# EAGLE design packmonitor (EAGLE 7.3.0)
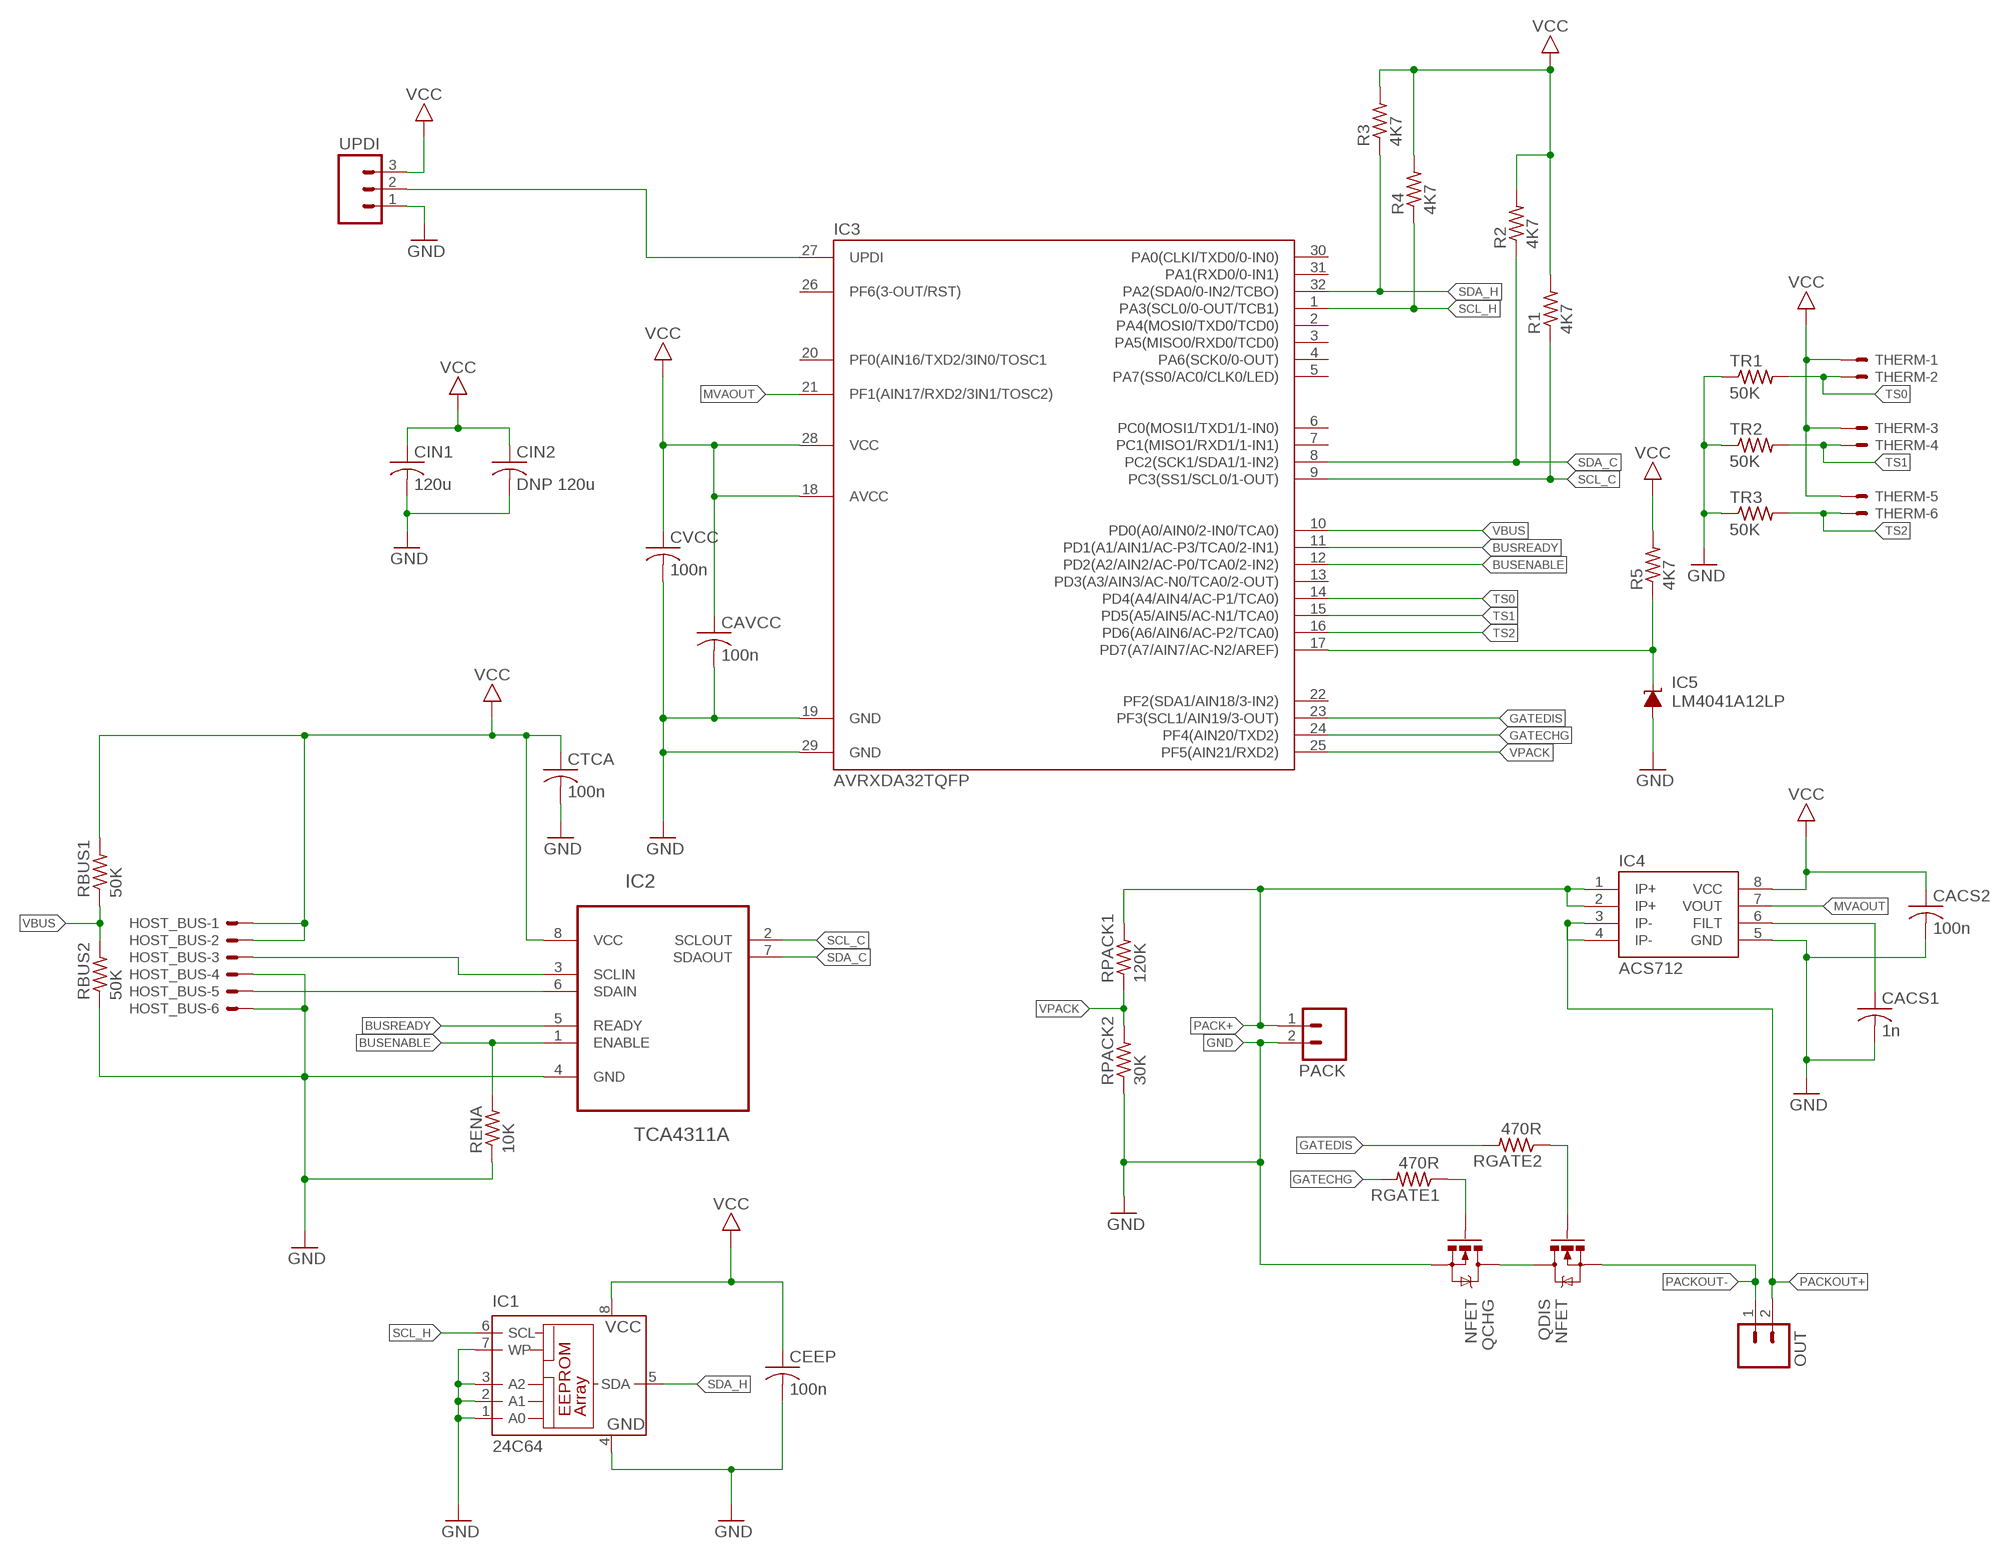
[diagram p0: schematic, sheet 1]

## Parts
CACS1  1n  C-USC0603  [C0603]
CACS2  100n  C-USC0603  [C0603]
CAVCC  100n  C-USC0603  [C0603]
CEEP  100n  C-USC0603  [C0603]
CIN1  120u  C-USC1206  [C1206]
CIN2  DNP 120u  C-USC1206  [C1206]
CTCA  100n  C-USC0603  [C0603]
CVCC  100n  C-USC0603  [C0603]
HOST_BUS  JST-XH-06-PIN-LONG-PAD  [JST-XH-06-PACKAGE-LONG-PAD]
IC1  24C64  24C04CSN  [SO-08]
IC2  TCA4311A  PCA9511AD,118  [SOIC127P600X175-8N]
IC3  AVRXDA32TQFP  [TQFP32-08]
IC4  ACS712  [SO08]
IC5  LM4041A12LP  [LP_O-PBCY-W3]
OUT  M023.5MM  [SCREWTERMINAL-3.5MM-2]
PACK  M023.5MM  [SCREWTERMINAL-3.5MM-2]
QCHG  NFET  MOSFET-NCHANNELFDS6630A  [SO08]
QDIS  NFET  MOSFET-NCHANNELFDS6630A  [SO08]
R1  4K7  R-US_R0603  [R0603]
R2  4K7  R-US_R0603  [R0603]
R3  4K7  R-US_R0603  [R0603]
R4  4K7  R-US_R0603  [R0603]
R5  4K7  R-US_R0603  [R0603]
RBUS1  50K  R-US_R0805  [R0805]
RBUS2  50K  R-US_R0805  [R0805]
RENA  10K  R-US_R0603  [R0603]
RGATE1  470R  R-US_R0603  [R0603]
RGATE2  470R  R-US_R0603  [R0603]
RPACK1  120K  R-US_R0805  [R0805]
RPACK2  30K  R-US_R0805  [R0805]
THERM  JST-XH-06-PIN-ROUND-PAD  [JST-XH-06-PACKAGE-ROUND-PAD]
TR1  50K  R-US_R0805  [R0805]
TR2  50K  R-US_R0805  [R0805]
TR3  50K  R-US_R0805  [R0805]
UPDI  M03PTH  [1X03]

## Nets
BUSENABLE: IC2.1(ENABLE) IC3.12(PD2(A2/AIN2/AC-P0/TCA0/2-IN2)) RENA.2
BUSREADY: IC2.5(READY) IC3.11(PD1(A1/AIN1/AC-P3/TCA0/2-IN1))
GATECHG: IC3.24(PF4(AIN20/TXD2)) RGATE1.2
GATEDIS: IC3.23(PF3(SCL1/AIN19/3-OUT)) RGATE2.2
GND: CACS1.2 CACS2.2 CAVCC.2 CEEP.2 CIN1.2 CIN2.2 CTCA.2 CVCC.2 HOST_BUS.4 HOST_BUS.6 IC1.1(A0) IC1.2(A1) IC1.3(A2) IC1.4(GND) IC1.7(WP) IC2.4(GND) IC3.19(GND) IC3.29(GND) IC4.5(GND) IC5.3(A) PACK.2 QCHG.1(S) QCHG.2(S) QCHG.3(S) RBUS2.1 RENA.1 RPACK2.1 TR1.1 TR2.1 TR3.1 UPDI.1
MVAOUT: IC3.21(PF1(AIN17/RXD2/3IN1/TOSC2)) IC4.7(VOUT)
N$1: QCHG.4(G) RGATE1.1
N$2: QDIS.4(G) RGATE2.1
N$3: CACS1.1 IC4.6(FILT)
N$4: IC3.17(PD7(A7/AIN7/AC-N2/AREF)) IC5.2(C) R5.1
PACK+: IC4.1(IP+) IC4.2(IP+) PACK.1 RPACK1.2
PACKOUT+: IC4.3(IP-) IC4.4(IP-) OUT.2
PACKOUT-: OUT.1 QDIS.1(S) QDIS.2(S) QDIS.3(S)
PDISC: QCHG.5(D) QCHG.6(D) QCHG.7(D) QCHG.8(D) QDIS.5(D) QDIS.6(D) QDIS.7(D) QDIS.8(D)
SCL_C: IC2.2(SCLOUT) IC3.9(PC3(SS1/SCL0/1-OUT)) R1.1
SCL_H: IC1.6(SCL) IC3.1(PA3(SCL0/0-OUT/TCB1)) R4.1
SCLIN: HOST_BUS.3 IC2.3(SCLIN)
SDA_C: IC2.7(SDAOUT) IC3.8(PC2(SCK1/SDA1/1-IN2)) R2.1
SDA_H: IC1.5(SDA) IC3.32(PA2(SDA0/0-IN2/TCBO)) R3.1
SDAIN: HOST_BUS.5 IC2.6(SDAIN)
TS0: IC3.14(PD4(A4/AIN4/AC-P1/TCA0)) THERM.2 TR1.2
TS1: IC3.15(PD5(A5/AIN5/AC-N1/TCA0)) THERM.4 TR2.2
TS2: IC3.16(PD6(A6/AIN6/AC-P2/TCA0)) THERM.6 TR3.2
UPDI: IC3.27(UPDI) UPDI.2
VBUS: IC3.10(PD0(A0/AIN0/2-IN0/TCA0)) RBUS1.1 RBUS2.2
VCC: CACS2.1 CAVCC.1 CEEP.1 CIN1.1 CIN2.1 CTCA.1 CVCC.1 HOST_BUS.1 HOST_BUS.2 IC1.8(VCC) IC2.8(VCC) IC3.18(AVCC) IC3.28(VCC) IC4.8(VCC) R1.2 R2.2 R3.2 R4.2 R5.2 RBUS1.2 THERM.1 THERM.3 THERM.5 UPDI.3
VPACK: IC3.25(PF5(AIN21/RXD2)) RPACK1.1 RPACK2.2
Unconnected: IC3.2(PA4(MOSI0/TXD0/TCD0)) IC3.3(PA5(MISO0/RXD0/TCD0)) IC3.4(PA6(SCK0/0-OUT)) IC3.5(PA7(SS0/AC0/CLK0/LED)) IC3.6(PC0(MOSI1/TXD1/1-IN0)) IC3.7(PC1(MISO1/RXD1/1-IN1)) IC3.13(PD3(A3/AIN3/AC-N0/TCA0/2-OUT)) IC3.20(PF0(AIN16/TXD2/3IN0/TOSC1) IC3.22(PF2(SDA1/AIN18/3-IN2)) IC3.26(PF6(3-OUT/RST)) IC3.30(PA0(CLKI/TXD0/0-IN0)) IC3.31(PA1(RXD0/0-IN1))

## Library data of the parts
CACS1 CACS2 CAVCC CEEP CIN1 CIN2 CTCA CVCC = rcl:C-US: CAPACITOR, American symbol
HOST_BUS THERM = Rembrandt Electronics - JST XH Connectors v1-0:JST-XH-06-PIN: JST XH Connector 2 Pin Wire to board connector. Pitch: 2,54 mm, (0.100") Number of pins: 6 Created by Rembrandt Electronics www.rembrandtelectronics.com
IC1 = microchip:24C*: Serial EEPROM 1 K/2 K/4 K; OC_FARNELL: unknown; OC_NEWARK: unknown
IC2 = NXP_By_element14_Batch_1:PCA9511AD,118: Hot swappable I2C-bus and SMBus bus buffer; MPN: PCA9511AD,118; OC_FARNELL: -; OC_NEWARK: 70R6468; PACKAGE: SOIC-8; SUPPLIER: NXP
IC3 = microchip-special:AVRXDA32: The AVR128DA28/32/48/64 microcontrollers of the AVR® DA family are using the AVR CPU with hardware multiplier, running at up to 24 MHz, with 128 KB of Flash, 16 KB of SRAM, and 512B of EEPROM in 28-, 32-, 48- or 64-pin packages. The AVR® DA family uses the latest technologies from Microchip Technology, with a flexible and low-power architecture including Event System, intelligent analog features, advanced digital peripherals and Peripheral Touch Controller (PTC).
IC4 = SparkFun-AnalogIC:ACS712: Hall-effect-based isolated linear current sensor; PROD_ID: IC-08964
IC5 = texas:LM4041: PRECISION MICROPOWER SHUNT VOLTAGE REFERENCE Source: http://focus.ti.com/lit/ds/slcs146e/slcs146e.pdf; OC_FARNELL: 9486119; OC_NEWARK: unknown
OUT PACK = SparkFun-Connectors:M02: Standard 2-pin 0.1" header. Use with - straight break away headers ( PRT-00116) - right angle break away headers (PRT-00553) - swiss pins (PRT-00743) - machine pins (PRT-00117) - female headers (PRT-00115) Molex polarized connector foot print use with: PRT-08233 with associated crimp pins and housings. 2.54_SCREWTERM for use with PRT-10571. 3.5mm Screw Terminal footprints for PRT-08084 5mm Screw Terminal footprints for use with PRT-08432; PROD_ID: CONN-08399
QCHG QDIS = SparkFun-DiscreteSemi:MOSFET-NCHANNEL: Common NMOSFET Parts MFG P/N Store ID Prod ID FDD8780 TRANS-09984 SI7820DN TRANS-11055 FDS6630A IC-08089 2N7002PW TRANS-11151 FQP30N06L COM-10213 TRANS-10060 BSS123LT1G TRANS-08345 BSS138 TRANS-00830 BS170 2N7000; PROD_ID: IC-08089
R1-R5 RBUS1 RBUS2 RENA RGATE1 RGATE2 RPACK1 RPACK2 TR1-TR3 = rcl:R-US_: RESISTOR, American symbol
UPDI = SparkFun-Connectors:M03: Header 3 Standard 3-pin 0.1" header. Use with straight break away headers (SKU : PRT-00116), right angle break away headers (PRT-00553), swiss pins (PRT-00743), machine pins (PRT-00117), and female headers (PRT-00115). Molex polarized connector foot print use with SKU : PRT-08232 with associated crimp pins and housings.

## Board
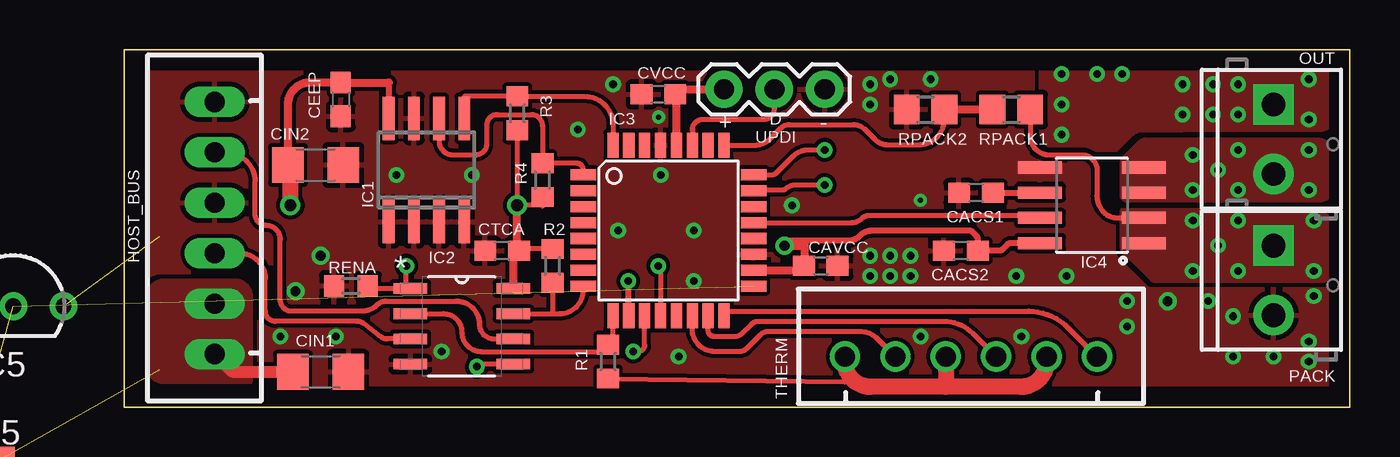
[diagram p1: board, top side]
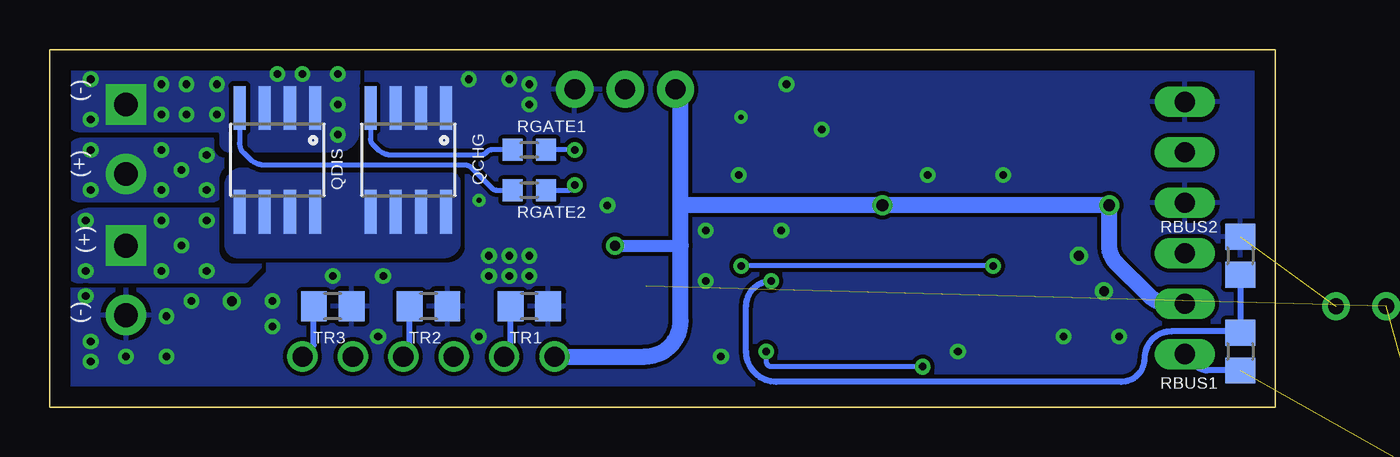
[diagram p2: board, bottom side, seen from below]

Size 61.76 x 18 mm. Coordinates in mm from the lower left corner, seen from the top.
Outline: 0,0 61.76,0 61.76,18 0,18 0,0
Copper layers (1*16): Top 0.035mm / dielectric 1.5mm / Bottom 0.035mm
Design rules "default": minimum track width 10mil, minimum drill 24mil, track to track 8mil, track to pad 8mil, pad to pad 8mil, via to via 8mil, smd to smd 8mil, copper to edge 40mil, drill to drill 8mil, minimum pad ring 10mil, minimum via ring 8mil, stop-mask expansion 4mil, vias tented up to drill 0mil, thermal gap 10mil

### Footprints (pad centres in the part's own frame; a part is rotated, then mirrored left to right if it is on the bottom)
C0603 = smd 1.1 x 1: 1 -0.85,0; 2 0.85,0
C1206 = smd 1.6 x 1.8: 1 -1.4,0; 2 1.4,0
JST-XH-06-PACKAGE-LONG-PAD = drill 1.016 long: 1 -6.35,0; 2 -3.81,0; 3 -1.27,0; 4 1.27,0; 5 3.81,0; 6 6.35,0
SO-08 = smd 0.6 x 2.2: 1 -1.905,-2.6; 2 -0.635,-2.6; 3 0.635,-2.6; 4 1.905,-2.6; 5 1.905,2.6; 6 0.635,2.6; 7 -0.635,2.6; 8 -1.905,2.6
SOIC127P600X175-8N = smd 1.702 x 0.533: 1 -2.591,1.905; 2 -2.591,0.635; 3 -2.591,-0.635; 4 -2.591,-1.905; 5 2.591,-1.905; 6 2.591,-0.635; 7 2.591,0.635; 8 2.591,1.905
TQFP32-08 = smd 1.27 x 0.559: 1 -4.293,2.8; 2 -4.293,2; 3 -4.293,1.2; 4 -4.293,0.4; 5 -4.293,-0.4; 6 -4.293,-1.2; 7 -4.293,-2; 8 -4.293,-2.8; 17 4.293,-2.8; 18 4.293,-2; 19 4.293,-1.2; 20 4.293,-0.4; 21 4.293,0.4; 22 4.293,1.2; 23 4.293,2; 24 4.293,2.8 | smd 0.559 x 1.27: 9 -2.8,-4.293; 10 -2,-4.293; 11 -1.2,-4.293; 12 -0.4,-4.293; 13 0.4,-4.293; 14 1.2,-4.293; 15 2,-4.293; 16 2.8,-4.293; 25 2.8,4.293; 26 2,4.293; 27 1.2,4.293; 28 0.4,4.293; 29 -0.4,4.293; 30 -1.2,4.293; 31 -2,4.293; 32 -2.8,4.293
SO08 = smd 0.61 x 2.21: 1 -1.905,-2.616; 2 -0.635,-2.616; 3 0.635,-2.616; 4 1.905,-2.616; 5 1.905,2.616; 6 0.635,2.616; 7 -0.635,2.616; 8 -1.905,2.616
LP_O-PBCY-W3 = drill 0.8 pad 1.4: 1 -2.54,0; 2 0,0; 3 2.54,0
SCREWTERMINAL-3.5MM-2 = drill 1.2 pad 2.032 square: 1 0,0 | drill 1.2 pad 2.032: 2 3.5,0
R0603 = smd 1 x 1.1: 1 -0.85,0; 2 0.85,0
R0805 = smd 1.3 x 1.5: 1 -0.95,0; 2 0.95,0
JST-XH-06-PACKAGE-ROUND-PAD = drill 1.016: 1 -6.35,0; 2 -3.81,0; 3 -1.27,0; 4 1.27,0; 5 3.81,0; 6 6.35,0
1X03 = drill 1.016 pad 1.88: 1 0,0; 2 2.54,0; 3 5.08,0

### Placement (x,y rotation side)
CACS1  42.93,10.79 180 top
CACS2  42.16,7.87 180 top
CAVCC  35.1,7.11 0 top
CEEP  10.92,15.49 270 top
CIN1  9.91,1.78 0 top
CIN2  9.65,12.19 0 top
CTCA  19.05,7.87 180 top
CVCC  26.92,15.75 180 top
HOST_BUS  4.57,9.02 90 top
IC1  15.24,11.94 0 top
IC2  17.02,4.06 0 top
IC3  27.43,8.89 0 top
IC4  48.77,10.16 90 top
IC5  -5.59,5.08 0 top  (outside the outline)
OUT  57.91,15.24 270 top
PACK  57.91,8.13 270 top
QCHG  43.69,12.45 180 bottom
QDIS  50.29,12.45 180 bottom
R1  24.38,2.29 270 top
R2  21.59,7.11 90 top
R3  19.81,14.8 270 top
R4  21.08,11.43 270 top
R5  -6.86,-2.54 0 top  (outside the outline)
RBUS1  1.78,2.79 270 bottom
RBUS2  1.78,7.62 270 bottom
RENA  11.43,6.1 0 top
RGATE1  37.59,12.95 0 bottom
RGATE2  37.59,10.92 0 bottom
RPACK1  44.7,14.99 0 top
RPACK2  40.39,14.99 0 top
THERM  42.67,2.54 0 top
TR1  37.59,5.08 180 bottom
TR2  42.67,5.08 180 bottom
TR3  47.5,5.08 180 bottom
UPDI  35.31,16 180 top

### Tracks (layer width: path | path; a pad name or v marks a point on that pad's centre or on a via)
BUSENABLE  (via drill 0.38)
  Top 0.254: v14.22,7.11 14.22,6.17 IC2.1 12.28,5.97 RENA.2 | v26.92,7.11 27.03,7 IC3.12
  Bottom 0.254: v14.22,7.11 v26.92,7.11
BUSREADY  (via drill 0.38)
  Top 0.254: v25.65,2.79 25.91,2.79 arc90 26.23,3.12 IC3.11 | IC2.5 17.78,2.16 v17.78,2.03
  Bottom 0.254: v17.78,2.03 25.4,2.03 arc90 25.65,2.29 v25.65,2.79
GATECHG  (via drill 0.38)
  Top 0.254: IC3.24 32.62,11.69 arc45 32.88,11.8 33.73,12.65 arc-45 34.47,12.95 v35.31,12.95
  Bottom 0.254: v35.31,12.95 RGATE1.2
GATEDIS  (via drill 0.38)
  Top 0.254: v35.31,11.18 33.78,11.18 arc45 33.35,11 arc-45 33.17,10.92 31.76,10.92 IC3.23
  Bottom 0.254: RGATE2.2 35.56,10.92 v35.31,11.18
GND  (via drill 0.25, 0.38, 0.5)  (1 unrouted)
  other vias: 40.13,3.56 45.21,3.56 55.88,4.57 59.94,5.59 59.69,3.3 59.69,2.29 57.91,2.54 55.88,2.54 40.64,16.51 37.59,15.24 37.59,16.26 38.61,16.51 24.64,16.26 22.86,13.97 16,2.79 9.91,7.62 8.64,5.84 10.67,3.56 7.87,3.56 27.94,2.54 37.59,7.62 38.61,7.62 39.62,7.62 44.96,6.6 47.5,6.6 50.55,5.33 50.55,4.06 52.58,5.33 54.61,5.33 37.59,6.6 39.62,6.6 38.61,6.6 40.13,10.41 26.92,14.61 27.05,11.68 28.7,8.89 33.65,10.16 17.53,11.68 13.72,11.68 24.89,8.89 28.7,6.35
  pour Bottom (rank 5): 0,18 61.76,18 61.76,0 0,0
  pour Top (rank 6): 61.72,18.03 0,18.03 0,0 61.72,0
  pour Bottom (isolate 0.254, rank 4, no thermals): 39.88,18.03 45.47,18.03 45.47,12.95 39.88,12.95
  pour Top (isolate 0.254, rank 4, no thermals): 44.7,12.7 47.75,12.7 47.75,11.43 44.7,11.43
MVAOUT
  Top 0.254: IC3.21 36.67,9.29 arc45 37.19,9.51 arc-45 37.55,9.65 46.02,9.65 IC4.7
N$1
  Bottom 0.254: RGATE1.1 39.52,12.95 arc-45 39.7,12.88 39.8,12.77 arc45 39.98,12.7 44.54,12.7 arc45 45.26,13 45.47,13.22 arc45 45.59,13.5 QCHG.4
N$2
  Bottom 0.254: QDIS.4 52.2,13.3 arc-45 51.99,12.8 51.74,12.54 arc-45 50.88,12.19 40.85,12.19 arc45 40.49,12.04 39.44,11 arc-45 39.27,10.92 RGATE2.1
N$3
  Top 0.305: CACS1.1 IC4.6
N$4  (2 unrouted)
PACK+  (via drill 0.38)
  Top 0.254: IC4.2 50.03,9.53 arc-45 49.39,9.79 arc-45 49.02,10.69 49.02,11.94 arc90 48.26,12.7 46.62,12.7 arc-90 45.65,13.67 RPACK1.2
  other vias: 56.13,9.4 56.13,6.86 55.12,8.13 53.85,9.4 53.85,6.86 59.94,9.4 59.94,6.86
  pour Top (isolate 0.254, rank 4, no thermals): 50.29,9.91 59.82,9.91 arc-90 60.96,8.77 60.96,7.11 arc-90 60.2,6.35 52.04,6.35 arc-45 51.8,6.45 50.39,7.86 arc-45 50.29,8.1
  pour Bottom (isolate 0.254, rank 4, no thermals): 50.29,9.91 59.69,9.91 arc-90 60.96,8.64 60.96,7.07 arc-90 60.24,6.35 52.04,6.35 arc-45 51.8,6.45 50.39,7.86 arc-45 50.29,8.1
PACKOUT+  (via drill 0.38)
  other vias: 53.85,12.7 53.85,10.92 56.13,12.95 56.13,10.92 55.12,11.94 59.69,10.92 59.69,12.95
  pour Top (isolate 0.254, rank 3, no thermals): 60.16,10.41 50.55,10.41 arc-90 50.29,10.67 50.29,12.3 arc-45 50.38,12.5 51.18,13.3 arc-45 51.57,13.46 60.04,13.46 arc-90 60.96,12.55 60.96,11.22 arc-90
  pour Bottom (isolate 0.254, rank 4, no thermals): 53.09,12.95 53.09,10.98 arc90 53.65,10.41 60.16,10.41 arc90 60.96,11.22 60.96,12.55 arc90 60.04,13.46 53.59,13.46 arc90
PACKOUT-  (via drill 0.38)
  other vias: 53.34,16.26 54.86,16.26 56.13,16.26 56.13,14.73 54.86,14.73 53.34,14.73 59.69,16.51 59.69,14.48 49.02,16.76 47.24,16.76 47.24,15.24 47.24,13.72 50.29,16.76
  pour Bottom (isolate 0.254, rank 3, no thermals): 52.73,12.95 47.28,12.95 arc-90 46.23,14 46.23,18.03 60.96,18.03 60.96,14.73 arc-90 60.2,13.97 53.34,13.97 arc90 53.09,13.72 53.09,13.31 arc-90
  pour Top (isolate 0.254, rank 4, no thermals): 53.09,13.72 53.09,13.31 arc-90 52.73,12.95 47.28,12.95 arc-90 46.23,14 46.23,18.03 60.96,18.03 60.96,14.73 arc-90 60.2,13.97 53.34,13.97 arc90
PDISC
  pour Bottom (isolate 0.254, rank 3, no thermals): 52.26,7.62 41.91,7.62 arc-90 41.15,8.38 41.15,11.18 arc-90 41.91,11.94 52.07,11.94 arc-90 52.83,11.18 52.83,8.19 arc-90
SCL_C
  Top 0.254: IC3.9 24.63,3.14 R1.1 24.13,2.79 18,2.79 arc-90 17.02,3.77 arc90 16.09,4.7 IC2.2
SCL_H
  Top 0.254: IC3.1 23.14,11.94 arc90 22.8,12.28 R4.1 21.08,14.16 arc90 20.51,14.73 18.8,14.73 arc90 18.29,14.22 18.29,13.27 arc-90 17.72,12.7 16.56,12.7 arc-90 15.88,13.38 IC1.6
SCLIN
  Top 0.254: HOST_BUS.3 5.84,7.75 arc-90 7.11,6.47 7.11,4.83 arc90 7.62,4.32 11.74,4.32 arc-38 12.09,4.2 12.93,3.54 arc38 13.27,3.43 IC2.3
SDA_C
  Top 0.254: IC2.7 21.59,4.7 | 21.59,4.7 21.95,4.7 arc90 23.14,5.89 IC3.8 | R2.1 21.59,4.7
SDA_H
  Top 0.254: IC1.5 17.14,15.65 R3.1 23.21,15.65 arc-90 24.63,14.22 IC3.32
SDAIN
  Top 0.254: HOST_BUS.5 5.12,12.83 arc-90 6.6,11.34 6.6,9.71 arc90 7.17,9.14 arc-90 7.87,8.44 7.87,5.39 arc90 8.44,4.83 11.96,4.83 arc45 12.79,5.17 arc-45 13.19,5.33 16.74,5.33 arc-90 17.91,4.17 arc90 18.65,3.43 IC2.6
TS0
  Top 0.254: IC3.14 28.63,3.92 arc90 29.76,2.79 31.01,2.79 arc45 31.35,2.93 32.07,3.65 arc-45 32.45,3.81 37.07,3.81 arc-45 37.96,3.44 THERM.2
  Bottom 0.305: THERM.2 38.54,2.86 TR1.2
TS1
  Top 0.254: IC3.15 29.43,3.84 arc90 29.72,3.56 30.78,3.56 arc45 31.14,3.71 31.6,4.17 arc-45 31.96,4.32 41.3,4.32 arc-45 42.78,3.71 THERM.4
  Bottom 0.305: THERM.4 43.62,2.86 TR2.2
TS2
  Top 0.254: THERM.6 47.56,4 arc45 45.57,4.83 30.23,4.83 IC3.16
  Bottom 0.305: THERM.6 48.45,3.11 TR3.2
UPDI
  Top 0.254: UPDI.2 32.77,15.05 arc-90 32.2,14.48 29.14,14.48 arc90 28.63,13.96 IC3.27
VBUS  (via drill 0.38)
  Top 0.305: 25.4,4.6 IC3.10 25.4,4.63 v25.4,6.35
  Bottom 0.254: RBUS1.1 1.78,3.81
  Bottom 0.305: v25.4,6.35 arc-90 26.67,5.08 26.67,2.79 arc-90 25.15,1.27 7.78,1.27 arc-90 6.6,2.44 arc90 5.24,3.81 1.78,3.81 | RBUS2.2 RBUS1.1
VCC  (via drill 0.5, 0.6)  (1 unrouted)
  Top 0.254: R1.2 36.32,1.27 THERM.1 | R2.2 19.9,7.96 CTCA.1 | R3.2 v19.81,10.16 21.08,10.16
  Top 0.305: 13.34,16.34 IC1.8 | v33.27,8.13 33.53,8.38 36.53,8.38 arc45 37.04,8.59 arc-45 37.76,8.89 42.57,8.89 arc-45 42.75,8.82 42.95,8.62 arc-45 43.01,8.45 CACS2.1 44.09,7.87 arc45 44.27,7.95 44.52,8.2 arc-45 44.65,8.26 IC4.8 | R4.2 21.08,10.16
  Top 0.406: IC3.28 27.83,15.75 CVCC.1 27.77,16 UPDI.3 | IC3.18 34.03,6.89 CAVCC.1 34.29,7.15 34.29,8.13 v33.27,8.13 | CIN2.1 8.25,15.23 arc-90 9.36,16.34 CEEP.1 13.34,16.34 | IC2.8 19.61,7.58 CTCA.1 19.81,7.96 v19.81,10.16
  Top 0.61: HOST_BUS.1 5.46,1.78 CIN1.1
  Top 0.813: THERM.5 46.48,2.31 arc-90 45.19,1.02 41.4,1.02 | 41.4,1.02 37.62,1.02 arc-90 36.32,2.31 THERM.1 | THERM.3 41.4,1.02 | CIN2.1 8.38,12.06 v8.38,10.16
  Bottom 0.305: RBUS1.2 3.45,1.84 arc45 3.96,2.06 HOST_BUS.1
  Bottom 0.61: v33.27,8.13 29.97,8.13
  Bottom 0.813: UPDI.3 arc90 29.97,15.85 29.97,10.16 | THERM.1 31.77,2.54 arc-90 29.97,4.34 29.97,8.13 29.97,10.16 | 29.97,10.16 v19.81,10.16 v8.38,10.16 8.38,8.15 arc-45 8.01,7.25 6.38,5.62 arc-45 5.39,5.21 HOST_BUS.2
  pour Top (rank 3, no thermals): 6.35,1.27 2.03,1.27 arc-90 1.27,2.03 1.27,5.59 arc-90 2.03,6.35 5.59,6.35 arc-90 6.35,5.59
VPACK
  Top 0.254: IC3.25 31.78,13.18 arc45 32.55,13.51 33.11,14.06 arc-45 33.51,14.22 36.75,14.22 arc-45 37.32,13.99 37.83,13.48 arc45 38.48,13.21 40.03,13.21 arc90 41.34,14.52 RPACK2.2
  Top 0.406: RPACK2.2 RPACK1.1

### Text on the board
tNames: + | D | -
bNames: (-) | (+) | (+) | (-)